# EAGLE design untitled (EAGLE 9.6.2)
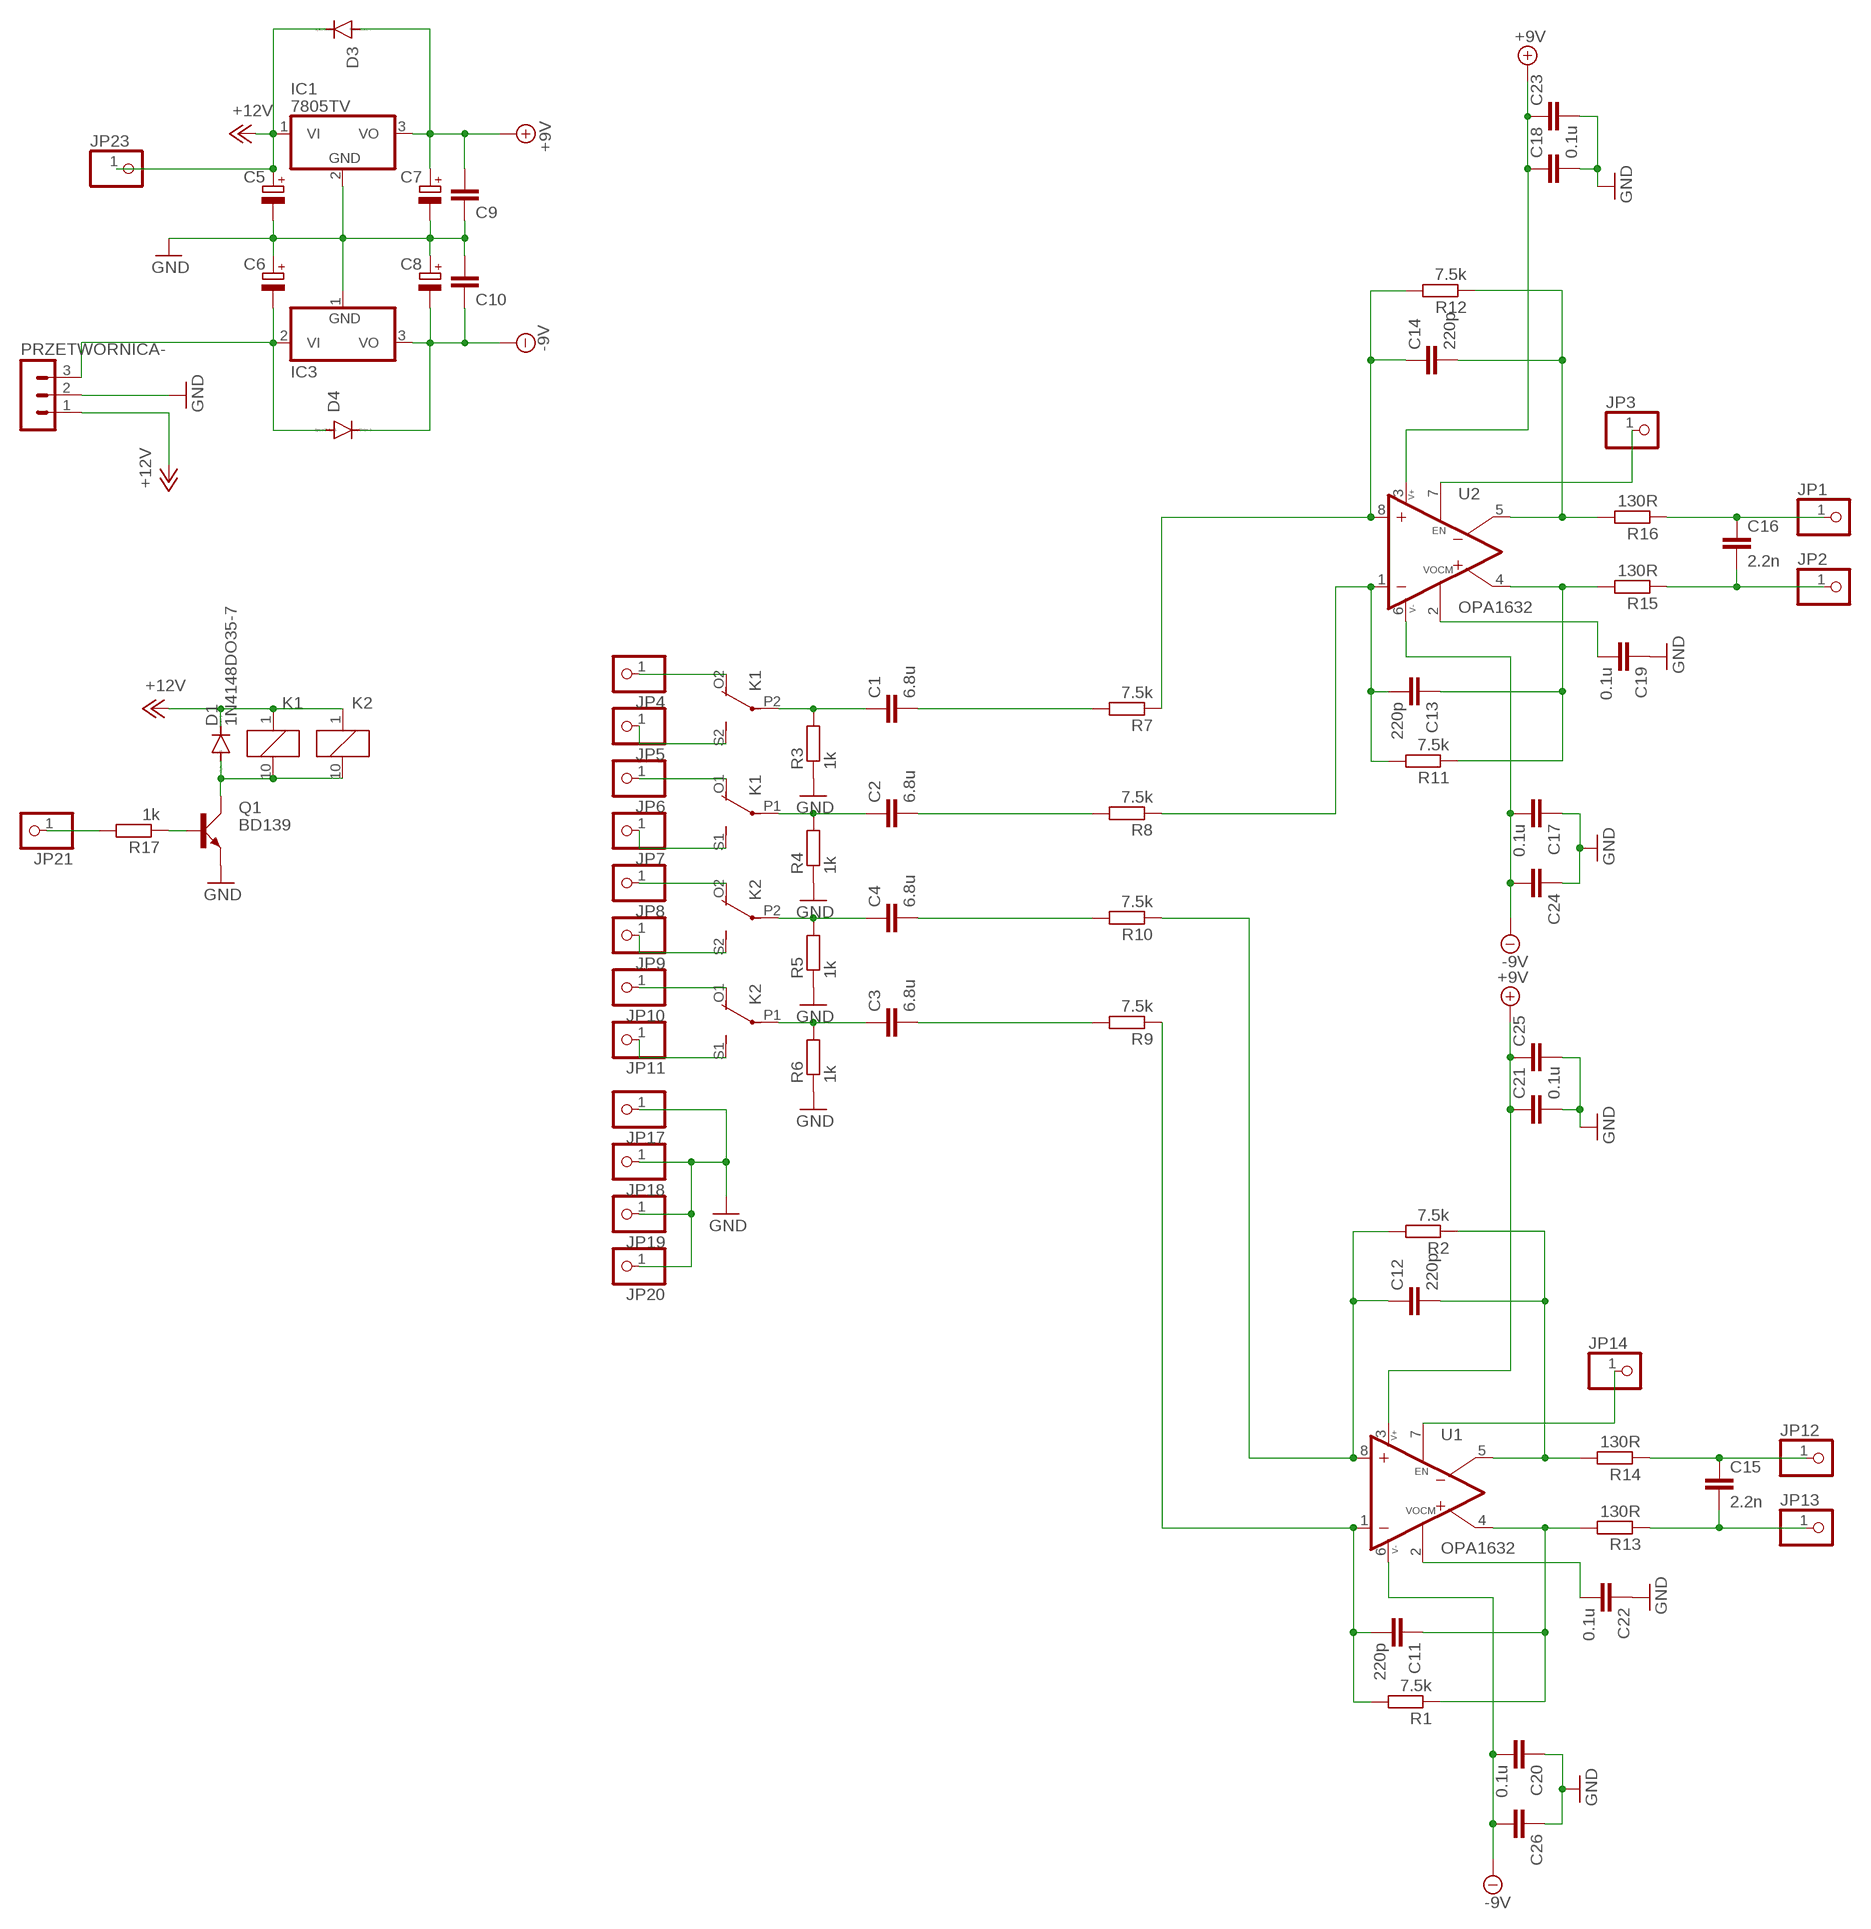
[diagram p0: schematic, sheet 1]

## Parts
C1  6.8u  C5/7.2  [C5B7.2]
C2  6.8u  C5/7.2  [C5B7.2]
C3  6.8u  C5/7.2  [C5B7.2]
C4  6.8u  C5/7.2  [C5B7.2]
C5  CPOL-EUE3.5-8  [E3,5-8]
C6  CPOL-EUE3.5-8  [E3,5-8]
C7  CPOL-EUE3.5-8  [E3,5-8]
C8  CPOL-EUE3.5-8  [E3,5-8]
C9  C-EU050-024X044  [C050-024X044]
C10  C-EU050-024X044  [C050-024X044]
C11  220p  C-EU075-032X103  [C075-032X103]
C12  220p  C-EU075-032X103  [C075-032X103]
C13  220p  C-EU075-032X103  [C075-032X103]
C14  220p  C-EU075-032X103  [C075-032X103]
C15  2.2n  C-EU025-024X044  [C025-024X044]
C16  2.2n  C-EU025-024X044  [C025-024X044]
C17  0.1u  C-EU025-024X044  [C025-024X044]
C18  0.1u  C-EU025-024X044  [C025-024X044]
C19  0.1u  C-EU025-024X044  [C025-024X044]
C20  0.1u  C-EU025-024X044  [C025-024X044]
C21  0.1u  C-EU025-024X044  [C025-024X044]
C22  0.1u  C-EU025-024X044  [C025-024X044]
C23  C-EU050-024X044  [C050-024X044]
C24  C-EU050-024X044  [C050-024X044]
C25  C-EU050-024X044  [C050-024X044]
C26  C-EU050-024X044  [C050-024X044]
D1  1N4148DO35-7  [DO35-7]
D3  1N4148DO35-7  [DO35-7]
D4  1N4148DO35-7  [DO35-7]
IC1  7805TV  [TO220V]
IC3  79  [TO220V]
JP1  PINHD-1X1  [1X01]
JP2  PINHD-1X1  [1X01]
JP3  PINHD-1X1  [1X01]
JP4  PINHD-1X1  [1X01]
JP5  PINHD-1X1  [1X01]
JP6  PINHD-1X1  [1X01]
JP7  PINHD-1X1  [1X01]
JP8  PINHD-1X1  [1X01]
JP9  PINHD-1X1  [1X01]
JP10  PINHD-1X1  [1X01]
JP11  PINHD-1X1  [1X01]
JP12  PINHD-1X1  [1X01]
JP13  PINHD-1X1  [1X01]
JP14  PINHD-1X1  [1X01]
JP17  PINHD-1X1  [1X01]
JP18  PINHD-1X1  [1X01]
JP19  PINHD-1X1  [1X01]
JP20  PINHD-1X1  [1X01]
JP21  PINHD-1X1  [1X01]
JP23  PINHD-1X1  [1X01]
K1  G6H2-100  [G6H2-100]
K2  G6H2-100  [G6H2-100]
PRZETWORNICA-  MA03-1  [MA03-1]
Q1  BD139  [TO126AV]
R1  7.5k  R-EU_0204/7  [0204/7]
R2  7.5k  R-EU_0204/7  [0204/7]
R3  1k  R-EU_0204/7  [0204/7]
R4  1k  R-EU_0204/7  [0204/7]
R5  1k  R-EU_0204/7  [0204/7]
R6  1k  R-EU_0204/7  [0204/7]
R7  7.5k  R-EU_0204/5  [0204/5]
R8  7.5k  R-EU_0204/5  [0204/5]
R9  7.5k  R-EU_0204/5  [0204/5]
R10  7.5k  R-EU_0204/5  [0204/5]
R11  7.5k  R-EU_0204/7  [0204/7]
R12  7.5k  R-EU_0204/7  [0204/7]
R13  130R  R-EU_0204/5  [0204/5]
R14  130R  R-EU_0204/5  [0204/5]
R15  130R  R-EU_0204/5  [0204/5]
R16  130R  R-EU_0204/5  [0204/5]
R17  1k  R-EU_0204/7  [0204/7]
U1  OPA1632  [PRZEJSCIOWKA]
U2  OPA1632  [PRZEJSCIOWKA]

## Nets
+9V: C7.+ C9.2 C18.1 C21.1 C23.1 C25.1 D3.A IC1.3(VO) U1.3(V+) U2.3(V+)
+12V: C5.+ D1.C D3.C IC1.1(VI) JP23.1 K1.1 K2.1 PRZETWORNICA-.1
-9V: C8.- C10.1 C17.2 C20.2 C24.2 C26.2 D4.C IC3.3(VO) U1.6(V-) U2.6(V-)
GND: C5.- C6.+ C7.- C8.+ C9.1 C10.2 C17.1 C18.2 C19.1 C20.1 C21.2 C22.1 C23.2 C24.1 C25.2 C26.1 IC1.2(GND) IC3.1(GND) JP17.1 JP18.1 JP19.1 JP20.1 PRZETWORNICA-.2 Q1.E R3.1 R4.1 R5.1 R6.1
N$1: JP4.1 K1.O2(3:O)
N$2: JP5.1 K1.S2(3:S)
N$3: JP6.1 K1.O1(2:O)
N$4: JP7.1 K1.S1(2:S)
N$5: D1.A K1.10 K2.10 Q1.C
N$6: JP10.1 K2.O1(2:O)
N$7: C12.1 R2.2 R10.1 U1.8(+IN)
N$8: Q1.B R17.1
N$9: JP9.1 K2.S2(3:S)
N$10: JP11.1 K2.S1(2:S)
N$11: JP8.1 K2.O2(3:O)
N$12: C3.2 R9.2
N$13: C3.1 K2.P1(2:P) R6.2
N$14: C4.1 K2.P2(3:P) R5.2
N$15: C2.1 K1.P1(2:P) R4.2
N$16: C1.1 K1.P2(3:P) R3.2
N$17: C1.2 R7.2
N$18: C2.2 R8.2
N$19: C4.2 R10.2
N$20: JP21.1 R17.2
N$21: C14.1 R7.1 R12.2 U2.8(+IN)
N$22: C13.2 R8.1 R11.2 U2.1(-IN)
N$23: C11.2 R1.2 R9.1 U1.1(-IN)
N$24: C13.1 R11.1 R15.2 U2.4(+OUT)
N$25: C6.- D4.A IC3.2(VI) PRZETWORNICA-.3
N$27: C14.2 R12.1 R16.2 U2.5(-OUT)
N$28: C16.1 JP1.1 R16.1
N$29: C16.2 JP2.1 R15.1
N$30: C11.1 R1.1 R13.2 U1.4(+OUT)
N$31: C12.2 R2.1 R14.2 U1.5(-OUT)
N$34: C19.2 U2.2(VOCM)
N$35: JP3.1 U2.7(EN)
N$36: C15.1 JP12.1 R14.1
N$37: C15.2 JP13.1 R13.1
N$40: C22.2 U1.2(VOCM)
N$41: JP14.1 U1.7(EN)

## Library data of the parts
C1-C4 = capacitor-wima:C: CAPACITOR naming: grid - package width
C5-C8 = rcl:CPOL-EU: POLARIZED CAPACITOR, European symbol; SPICEPREFIX: C
C9-C26 = rcl:C-EU: CAPACITOR, European symbol; SPICEPREFIX: C
D1 D3 D4 = diode:1N4148: DIODE high speed (Philips)
IC1 = linear:78*: Positive VOLTAGE REGULATOR Source: http://cache.national.com/ds/LM/LM78L05.pdf http://www.fairchildsemi.com/ds/LM/LM7805.pdf
IC3 = linear_moja:79*: Negative VOLTAGE REGULATOR; 7905TV: 7905
JP1-JP14 JP17-JP21 JP23 = pinhead:PINHD-1X1: PIN HEADER
K1 K2 = relay:G6H2-100: RELAY 2 x switch, 0.5 A/125 V AC, 1 A/30 V DC, Omron; OC_FARNELL: unknown; OC_NEWARK: unknown
PRZETWORNICA- = con-lstb:MA03-1: PIN HEADER; OC_FARNELL: unknown; OC_NEWARK: unknown
Q1 = transistor-power:BD139: NPN TRANSISTOR
R1-R17 = rcl:R-EU_: RESISTOR, European symbol; SPICEPREFIX: R
U1 U2 = OPA1632:OPA1632: OP-AMP Audio Grade, Fully-Differential Check availability <https://pricing.snapeda.com/parts/OPA1632/Texas%20Instruments/view-part?ref=eda>

## Board
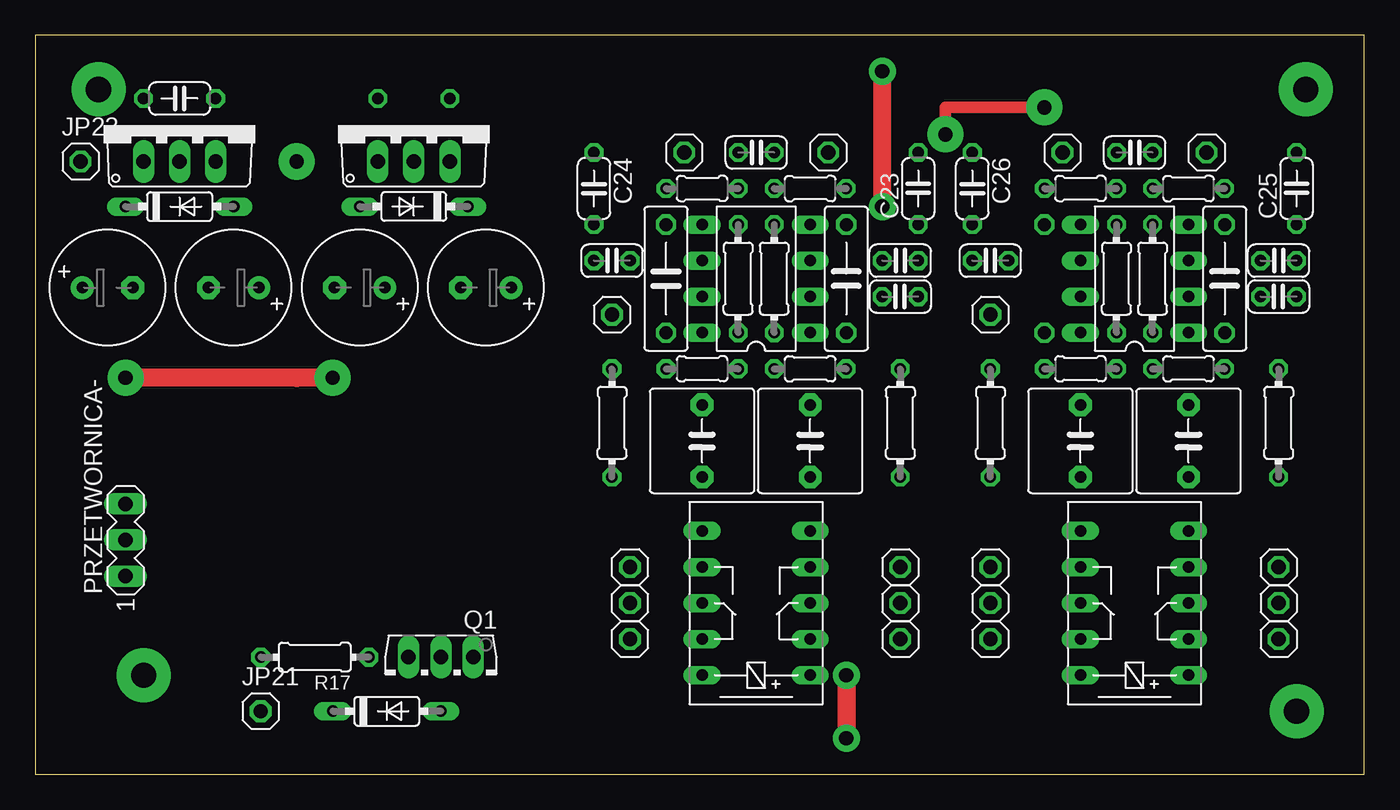
[diagram p1: board, top side]
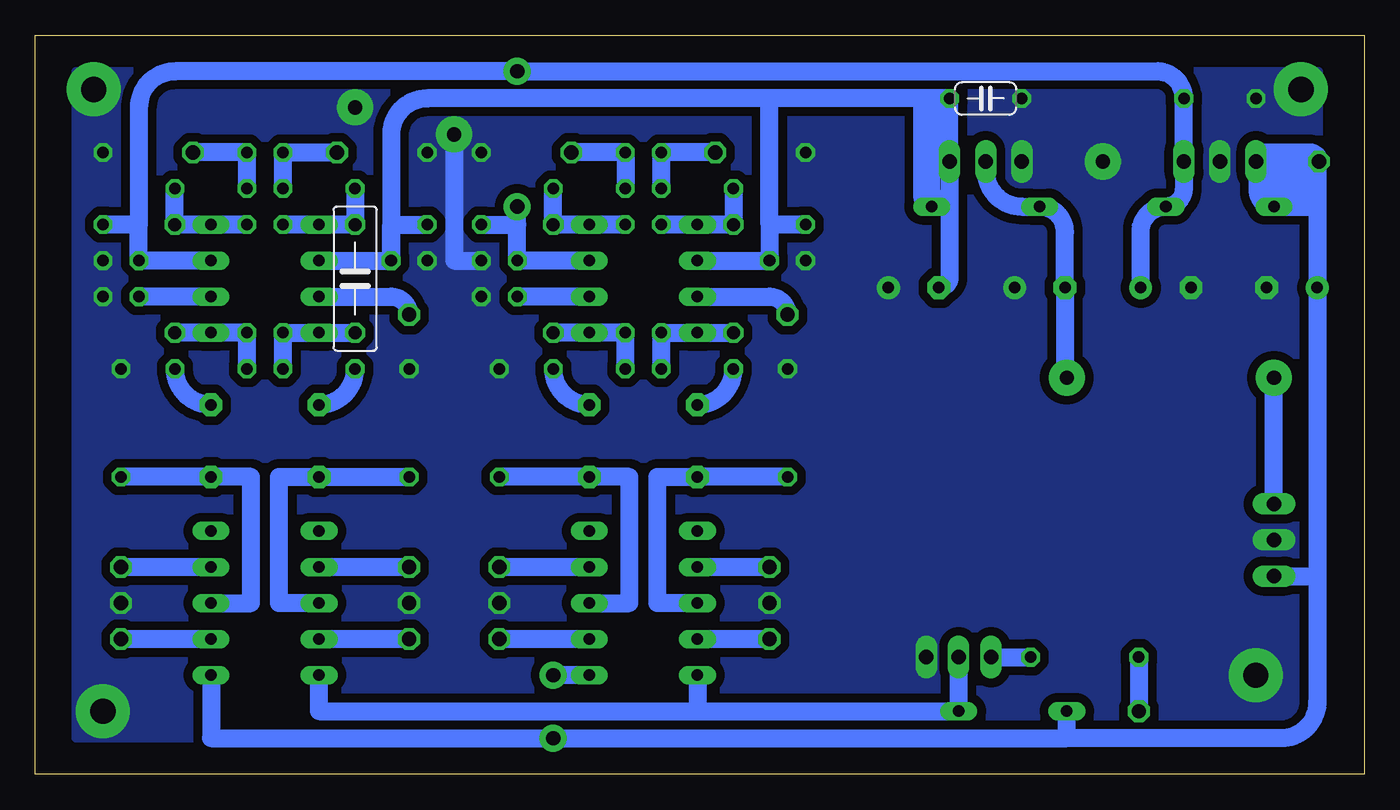
[diagram p2: board, bottom side, seen from below]

Size 93.65 x 52.06 mm. Coordinates in mm from the lower left corner, seen from the top.
Outline: 0,0 93.65,0 93.65,52.06 0,52.06 0,0
Copper layers (1*16): Top 0.035mm / dielectric 1.5mm / Bottom 0.035mm
Design rules "default *": minimum track width 6mil, minimum drill 0.35mm, track to track 6mil, track to pad 6mil, pad to pad 6mil, via to via 6mil, smd to smd 6mil, copper to edge 40mil, drill to drill 6mil, minimum pad ring 10mil, minimum via ring 8mil, stop-mask expansion 4mil, vias tented up to drill 0mil, thermal gap 10mil

### Footprints (pad centres in the part's own frame; a part is rotated, then mirrored left to right if it is on the bottom)
C5B7.2 = drill 0.813 pad 1.6 octagon: 1 -2.54,0; 2 2.54,0
E3,5-8 = drill 0.813 pad 1.6: + -1.778,0 | drill 0.813 pad 1.6 octagon: - 1.778,0
C050-024X044 = drill 0.813 octagon: 1 -2.54,0; 2 2.54,0
C075-032X103 = drill 0.914 octagon: 1 -3.81,0; 2 3.81,0
C025-024X044 = drill 0.813 octagon: 1 -1.27,0; 2 1.27,0
DO35-7 = drill 0.813 long: A 3.81,0; C -3.81,0
TO220V = drill 1.016 long: 1 -2.54,-2.54; 2 0,-2.54; 3 2.54,-2.54
1X01 = drill 1.016 octagon: 1 0,0
G6H2-100 = drill 0.813 long: 1 -5.08,-3.81; 5 5.08,-3.81; 6 5.08,3.81; 10 -5.08,3.81; O1 -2.54,-3.81; O2 -2.54,3.81; P1 0,-3.81; P2 0,3.81; S1 2.54,-3.81; S2 2.54,3.81
MA03-1 = drill 1.016 long: 1 -2.54,0; 2 0,0; 3 2.54,0
TO126AV = drill 1.016 long: B 2.286,-1.27; C 0,-1.27; E -2.286,-1.27
0204/7 = drill 0.813 octagon: 1 -3.81,0; 2 3.81,0
0204/5 = drill 0.813 octagon: 1 -2.54,0; 2 2.54,0
PRZEJSCIOWKA = drill 0.813 long: 1 -3.81,-3.81; 2 -1.27,-3.81; 3 1.27,-3.81; 4 3.81,-3.81; 5 3.81,3.81; 6 1.27,3.81; 7 -1.27,3.81; 8 -3.81,3.81

### Placement (x,y rotation side)
C1  46.99,23.5 90 top
C2  54.61,23.5 90 top
C3  81.28,23.5 90 top
C4  73.66,23.5 90 top
C5  5.08,34.29 0 top
C6  22.86,34.29 180 top
C7  13.97,34.29 180 top
C8  31.75,34.29 180 top
C9  10.16,47.62 0 top
C10  26.67,47.62 0 bottom
C11  83.82,34.93 270 top
C12  71.12,34.93 90 bottom
C13  57.15,34.93 270 top
C14  44.45,34.93 90 top
C15  77.47,43.81 0 top
C16  50.8,43.81 0 top
C17  40.64,36.2 0 top
C18  60.96,36.2 0 top
C19  60.96,33.66 180 top
C20  67.31,36.2 0 top
C21  87.63,36.2 0 top
C22  87.63,33.66 180 top
C23  62.23,41.27 90 top
C24  39.37,41.27 270 top
C25  88.9,41.27 90 top
C26  66.04,41.27 270 top
D1  24.77,4.45 0 top
D3  10.16,40.01 0 top
D4  26.67,40.01 180 top
IC1  10.16,45.72 0 top
IC3  26.67,45.72 0 top
JP1  45.72,43.81 0 top
JP2  55.88,43.81 0 top
JP3  40.64,32.38 0 top
JP4  41.91,9.52 180 top
JP5  41.91,14.61 180 top
JP6  60.96,9.52 0 top
JP7  60.96,14.61 0 top
JP8  67.31,9.52 0 top
JP9  67.31,14.61 0 top
JP10  87.63,9.52 0 top
JP11  87.63,14.61 0 top
JP12  72.39,43.81 0 top
JP13  82.55,43.81 0 top
JP14  67.31,32.38 0 top
JP17  41.91,12.07 180 top
JP18  60.96,12.07 0 top
JP19  67.31,12.07 0 top
JP20  87.63,12.07 0 top
JP21  15.87,4.45 0 top
JP23  3.18,43.18 0 top
K1  50.8,12.07 90 top
K2  77.47,12.07 90 top
PRZETWORNICA-  6.35,16.51 90 top
Q1  28.57,6.99 180 top
R1  78.74,34.93 270 top
R2  76.2,34.93 270 top
R3  40.64,24.77 270 top
R4  60.96,24.77 270 top
R5  67.31,24.77 270 top
R6  87.63,24.77 270 top
R7  46.99,28.57 180 top
R8  54.61,28.57 0 top
R9  81.28,28.57 0 top
R10  73.66,28.57 180 top
R11  52.07,34.93 270 top
R12  49.53,34.93 270 top
R13  81.28,41.27 0 top
R14  73.66,41.27 180 top
R15  54.61,41.27 0 top
R16  46.99,41.27 180 top
R17  19.69,8.25 180 top
U1  77.47,34.93 90 top
U2  50.8,34.93 90 top

### Tracks (layer width: path | path; a pad name or v marks a point on that pad's centre or on a via)
+9V  (via drill 1 pad 1.91)
  Top 1.27: v59.69,40.01 v59.69,49.53
  Bottom 1.27: U2.3 C18.1 59.69,38.73 | U1.3 C21.1 86.36,38.73 | C23.1 59.69,38.73 | 86.36,38.73 C25.1 | 86.36,38.73 86.36,46.99 arc90 83.82,49.53 v59.69,49.53 14.6,49.53 arc90 C9.2 IC1.3 12.7,41.27 arc90 D3.A arc-90 15.75,38.23 C7.+ | 59.69,38.73 v59.69,40.01
+12V  (via drill 1 pad 1.91)
  Top 1.27: v57.15,6.99 v57.15,2.54
  Bottom 1.27: K1.1 v57.15,6.99 | K2.1 81.28,2.54 v57.15,2.54 20.96,2.54 | 20.96,2.54 D1.C | 3.3,41.91 3.3,43.05 7.49,43.05 | 3.3,41.91 3.3,40.64 | 3.3,40.64 3.3,40.01 | 3.3,40.01 C5.+ 3.3,13.97 | 20.96,2.54 5.84,2.54 arc-90 3.3,5.08 3.3,13.97 | PRZETWORNICA-.1 3.3,13.97 | 3.3,40.01 D3.C arc90 7.49,41.15 7.49,43.05 | 7.49,43.05 arc90 IC1.1 arc90 6.98,43.81 3.81,43.81 arc90 JP23.1 | 3.3,41.91 6.98,41.91 | 3.3,40.64 5.71,40.64 arc90 6.35,41.27
-9V
  Bottom 1.27: U2.6 C17.2 41.91,38.73 | U1.6 C20.2 | C20.2 68.58,38.73 C26.2 | C24.2 41.91,38.73 | 41.91,38.73 41.91,47.62 | 29.85,34.42 arc90 C8.- arc-90 29.21,35.05 IC3.3 | IC3.3 C10.1 41.91,47.62 | IC3.3 29.21,41.27 arc90 D4.C | 41.91,47.62 66.04,47.62 arc-90 68.58,45.09 C20.2 | D4.C 30.48,46.99 | D4.C arc90 31.11,40.64 31.11,46.99
GND  (via drill 1 pad 2.54, 1.78 pad 3.81)
  Top 0.813: v64.13,45.09 64.13,46.99 v71.12,46.99
  Bottom 1.27: v64.13,45.09 64.13,36.2 C18.2
  other vias: 4.45,48.26 7.62,6.99 88.9,4.45 89.53,48.26 18.42,43.18
  pour Bottom (isolate 0.61, no thermals): 3.18,49.53 90.8,49.53 90.8,2.54 3.18,2.54
N$1
  Bottom 1.27: JP4.1 K1.O2
N$2
  Bottom 1.27: JP5.1 K1.S2
N$3
  Bottom 1.27: K1.O1 JP6.1
N$4
  Bottom 1.27: K1.S1 JP7.1
N$5
  Bottom 1.27: K1.10 46.99,4.45 | 46.99,4.45 73.66,4.45 K2.10 | 46.99,4.45 D1.A Q1.C
N$6
  Bottom 1.27: K2.O1 JP10.1
N$7
  Bottom 1.27: R10.1 R2.2 U1.8 C12.1
N$8
  Bottom 1.27: Q1.B R17.1
N$9
  Bottom 1.27: JP9.1 K2.S2
N$10
  Bottom 1.27: K2.S1 JP11.1
N$11
  Bottom 1.27: JP8.1 K2.O2
N$12
  Bottom 1.27: C3.2 arc90 R9.2
N$13
  Bottom 1.27: R6.2 C3.1 78.46,20.96 78.46,12.07 K2.P1
N$14
  Bottom 1.27: R5.2 C4.1 76.48,20.96 76.48,12.07 K2.P2
N$15
  Bottom 1.27: R4.2 C2.1 51.79,20.96 51.79,12.07 K1.P1
N$16
  Bottom 1.27: R3.2 C1.1 49.81,20.96 49.81,12.07 K1.P2
N$17
  Bottom 1.27: C1.2 arc-90 R7.2
N$18
  Bottom 1.27: C2.2 arc90 R8.2
N$19
  Bottom 1.27: C4.2 arc-90 R10.2
N$20
  Bottom 1.27: R17.2 JP21.1
N$21
  Bottom 1.27: R7.1 R12.2 U2.8 C14.1
N$22
  Bottom 1.27: R8.1 R11.2 U2.1 C13.2
N$23
  Bottom 1.27: R9.1 R1.2 U1.1 C11.2
N$24
  Bottom 1.27: R11.1 U2.4 C13.1 R15.2
N$25  (via drill 1 pad 2.54)
  Top 1.27: v20.96,27.94 18.42,27.94 v6.35,27.94
  Bottom 1.27: IC3.2 26.67,42.55 arc-90 24.13,40.01 D4.A arc90 21.08,38.23 C6.- 21.08,28.07 arc-90 v20.96,27.94 | PRZETWORNICA-.3 v6.35,27.94
N$27
  Bottom 1.27: R16.2 C14.2 U2.5 R12.1
N$28
  Bottom 1.27: R16.1 C16.1 JP1.1
N$29
  Bottom 1.27: JP2.1 C16.2 R15.1
N$30
  Bottom 1.27: R1.1 U1.4 C11.1 R13.2
N$31
  Bottom 1.27: R14.2 C12.2 U1.5 R2.1
N$34
  Bottom 1.27: U2.2 C19.2
N$35
  Bottom 1.27: U2.7 41.91,33.66 arc90 JP3.1
N$36
  Bottom 1.27: R14.1 C15.1 JP12.1
N$37
  Bottom 1.27: R13.1 C15.2 JP13.1
N$40
  Bottom 1.27: U1.2 C22.2
N$41
  Bottom 1.27: U1.7 68.58,33.66 arc90 JP14.1